# Altium schematic sheet Schem.SchDoc: Single cell LIPO battery charger
size A; DrawnBy: R Abhram; DocumentNumber: 1; Revision: V 1.0; SheetNumber: 1; SheetTotal: 1
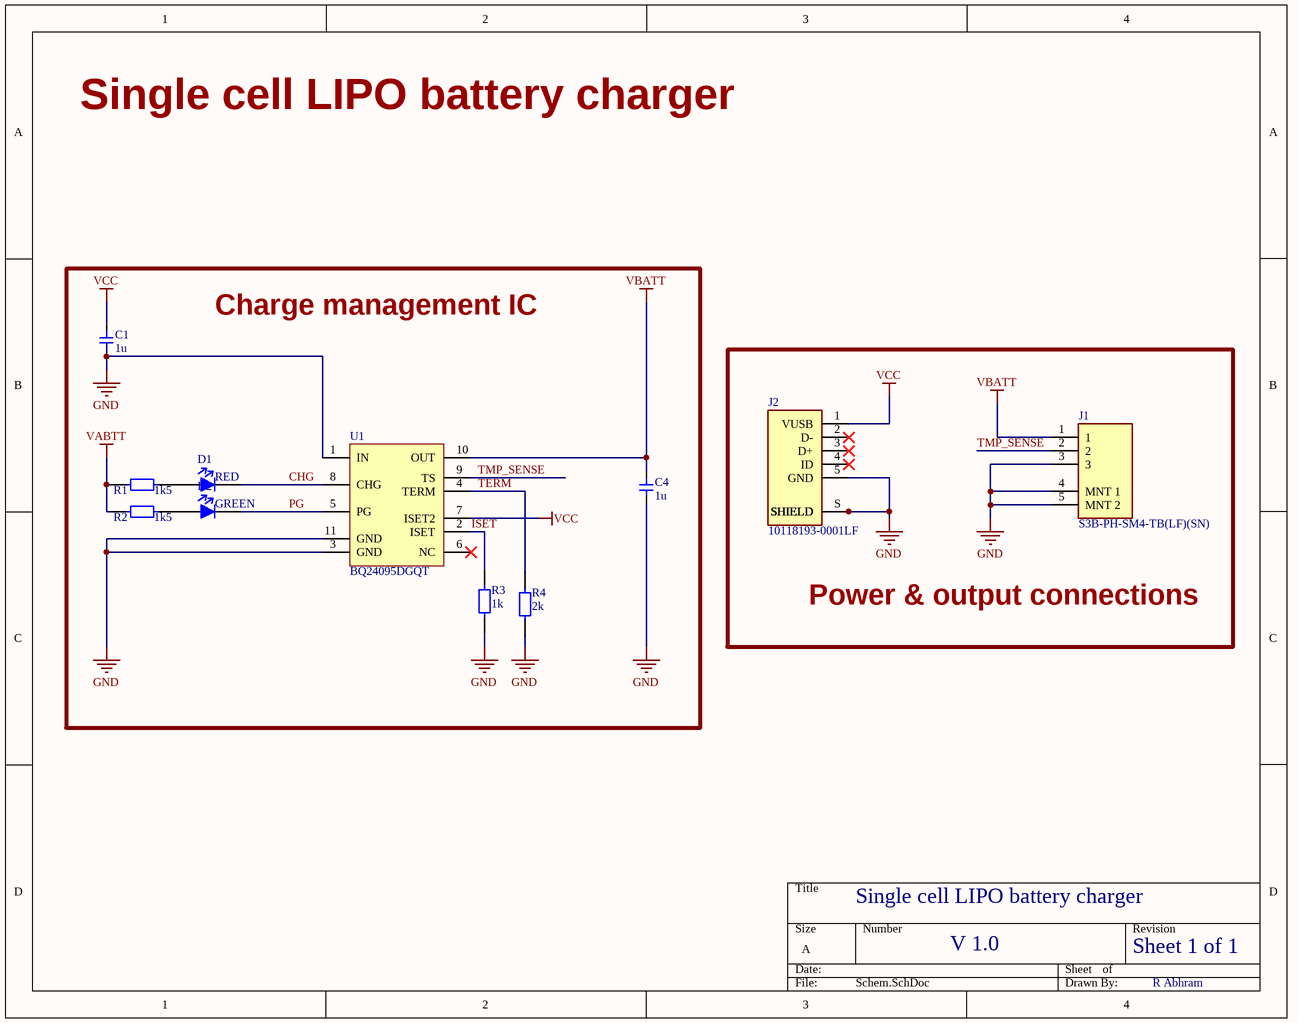
[diagram p0: Schem.SchDoc]

## Parts
C1  1u  [1U_0402_CAP]
C4  1u  [1U_0402_CAP]
D1  RED  [RED_LED]
D2  GREEN  [GREEN_LED]
J1  S3B-PH-SM4-TB(LF)(SN)  [JST_3POS]
J2  10118193-0001LF  [USB_PWR_CTR]
R1  1k5  [1K5_0402_RES]
R2  1k5  [1K5_0402_RES]
R3  1k  [1k_0402_RES]
R4  2k  [2K_0402_RES]
U1  BQ24095DGQT  [BATT_CHARGE_IC]

## Blocks framed on the sheet
Charge management IC: C1 C4 D1 D2 R1-R4 U1
Power & output connections: J1 J2

## Nets
GND: C1.1 C4.1 J1.3 J1.4(MNT_1) J1.5(MNT_2) J2.5(GND) J2.6(SHIELD) J2.S(SHIELD) R3.1 R4.1 U1.1(IN) U1.3(GND) U1.11(GND)
VABTT: R1.1 R2.1
VBATT: C4.2 J1.1 U1.10(OUT)
VCC: C1.2 J2.1(VUSB) U1.7(ISET2)
CHG: D1.2 U1.8(CHG)
ISET: R3.2 U1.2(ISET)
PG: D2.2 U1.5(PG)
TERM: R4.2 U1.4(TERM)
TMP_SENSE: J1.2 U1.9(TS)
NetD1_1: D1.1 R1.2
NetD2_1: D2.1 R2.2

Not connected (* = marked no-connect by the designer): J2 2(D-)* 3(D+)* 4(ID)*; U1 6(NC)*

## Notes on the sheet
- Sheet 1 of 1

## Library data of the parts
C1 C4 = CC0402KRX5R6BB105: CAP CER 1UF 10V X5R 0402; Manufacturer: Yageo; Material: 4241ConductorMaterial; Tolerance: 10%; Dissipation Factor: 15%; Supplier: Digikey; Supplier Part Number: 311-1439-1-ND; Manufacturer Part Number: CC0402KRX5R6BB105; RoHS: Yes; Category: Ceramic Capacitors; Stock: 603752; Pricing: 1=0.1, 10=0.07, 50=0.0418, 100=0.0329, 500=0.02428, 1000=0.0201, 2500=0.0187, 5000=0.01711 (USD); Mounting Technology: Surface Mount; Case/Package: 0402; Pins: 2; Case Code (Metric): 1005; Case Code (Imperial): 0402; Min Operating Temperature: -55°C; Max Operating Temperature: 85°C; Value: 1uF; Dielectric: X5R; Package Quantity: 1; Voltage Rating: 10V; Packaging: Tape and Reel; Voltage Rating (DC): 10V; Termination: SMD/SMT; Series: CC; Construction: Flat; Length: 1mm; Width: 0.02inch; Height: 0.5mm; Thickness: 0.022inch; Depth: 0.5mm; Radiation Hardening: No; Reach SVHC Compliant: No; RoHS Compliant: Yes; Halogen Free: 5694HalogenFree; Lead Free: 5697LeadFree; ComponentLink1URL: https://datasheet.ciiva.com/176/upy-gphc-x5r-4v-to-50v-12-176704.pdf?src-supplier=Digikey; ComponentLink1Description: https://datasheet.ciiva.com/176/upy-gphc-x5r-4v-to-50v-12-176704.pdf?src-supplier=Digikey; ComponentLink2URL: https://datasheet.ciiva.com/176/mlccorderingcode-176705.pdf?src-supplier=Digikey; ComponentLink2Description: https://datasheet.ciiva.com/176/mlccorderingcode-176705.pdf?src-supplier=Digikey; ComponentLink3URL: https://datasheet.ciiva.com/176/mlccorderingcode-176706.pdf?src-supplier=Digikey; ComponentLink3Description: https://datasheet.ciiva.com/176/mlccorderingcode-176706.pdf?src-supplier=Digikey
D1 = 150040RS73240: LED RED CLEAR 0402 SMD; Manufacturer: Wurth Electronics; Lens Color: Colorless; Lens Style: Flat; Luminous Intensity: 100mcd; Forward Voltage: 2V; Test Current: 20mA; Viewing Angle: 120°; Dominant Wavelength: 625nm; Forward Current: 60mA; Max Reverse Voltage (DC): 5V; Power Dissipation: 72mW; Lens Size: 0.5mm; Supplier: Digikey; Supplier Part Number: 732-11991-1-ND; Manufacturer Part Number: 150040RS73240; RoHS: Yes; Category: LEDs; Stock: 16784; Pricing: 1=0.31, 10=0.271, 100=0.244, 500=0.217, 1000=0.191 (USD); Mounting Technology: Surface Mount; Case/Package: 0402; Color: Red; Case Code (Imperial): 0402; Case Code (Metric): 1005; Min Operating Temperature: -40°C; Max Operating Temperature: 85°C; Packaging: Cut Tape; Lens Transparency: Clear; Series: WL-SMCC; Reverse Voltage: 5V; Wavelength: 625nm; Length: 1mm; Width: 0.5mm; Height: 0.5mm; RoHS Compliant: Yes; ComponentLink1URL: http://www.farnell.com/datasheets/2621636.pdf?src-supplier=Farnell; ComponentLink1Description: http://www.farnell.com/datasheets/2621636.pdf?src-supplier=Farnell; ComponentLink2URL: https://katalog.we-online.de/pbs/datasheet/150040RS73240.pdf?src-supplier=Digikey; ComponentLink2Description: https://katalog.we-online.de/pbs/datasheet/150040RS73240.pdf?src-supplier=Digikey; ComponentLink3URL: http://www.farnell.com/datasheets/2621636.pdf?src-supplier=Element14; ComponentLink3Description: http://www.farnell.com/datasheets/2621636.pdf?src-supplier=Element14; ComponentLink4URL: http://www.farnell.com/datasheets/2621636.pdf?src-supplier=Newark; ComponentLink4Description: http://www.farnell.com/datasheets/2621636.pdf?src-supplier=Newark
D2 = 150040VS73240: LED GREEN CLEAR 0402 SMD; Manufacturer: Wurth Electronics; Lens Color: Colorless; Lens Style: Flat; Luminous Intensity: 50mcd; Forward Voltage: 2V; Test Current: 20mA; Viewing Angle: 120°; Dominant Wavelength: 570nm; Forward Current: 60mA; Max Reverse Voltage (DC): 5V; Power Dissipation: 75mW; Lens Size: 0.5mm; Supplier: Digikey; Supplier Part Number: 732-11992-1-ND; Manufacturer Part Number: 150040VS73240; RoHS: Yes; Category: LEDs; Stock: 23651; Pricing: 1=0.31, 10=0.271, 100=0.244, 500=0.217, 1000=0.191 (USD); Mounting Technology: Surface Mount; Case/Package: 0402; Color: Green; Case Code (Imperial): 0402; Case Code (Metric): 1005; Min Operating Temperature: -40°C; Max Operating Temperature: 85°C; Packaging: Cut Tape; Lens Transparency: Clear; Series: WL-SMCC; Reverse Voltage: 5V; Wavelength: 570nm; Length: 1mm; Width: 0.5mm; Height: 0.5mm; RoHS Compliant: Yes; ComponentLink1URL: http://www.farnell.com/datasheets/2621637.pdf?src-supplier=Farnell; ComponentLink1Description: http://www.farnell.com/datasheets/2621637.pdf?src-supplier=Farnell; ComponentLink2URL: http://www.farnell.com/datasheets/2621637.pdf?src-supplier=Element14; ComponentLink2Description: http://www.farnell.com/datasheets/2621637.pdf?src-supplier=Element14; ComponentLink3URL: https://katalog.we-online.de/pbs/datasheet/150040VS73240.pdf?src-supplier=Digikey; ComponentLink3Description: https://katalog.we-online.de/pbs/datasheet/150040VS73240.pdf?src-supplier=Digikey; ComponentLink4URL: http://www.farnell.com/datasheets/2621637.pdf?src-supplier=Newark; ComponentLink4Description: http://www.farnell.com/datasheets/2621637.pdf?src-supplier=Newark
J1 = S3B-PH-SM4-TB(LF)(SN): Connector Header, PH Series, 3 Position, Side Entry, 2.00mm, Solder, Surface Mount, Natural.; Manufacturer: JST; Current Rating: 2A; Voltage Rating: 100V; Contact Resistance: 10mR; Number of Poles: 3; Insulation Resistance: 1GR; Gender: Male; Pitch: 2mm; Supplier: Farnell; Supplier Part Number: 9492623; Manufacturer Part Number: S3B-PH-SM4-TB(LF)(SN); RoHS: Yes; Category: Headers and Wire Housings; Stock: 62261; Pricing: 10=0.409, 100=0.29, 500=0.246, 1000=0.215, 2500=0.2, 5000=0.187 (GBP); Mounting Technology: Surface Mount; Contact Material: Copper Alloy,Tin,Bronze,Brass; Contact Plating: Tin,Copper; Color: Natural,White; Housing Color: Beige; Housing Material: Polyamide; Material: Polyamide; Contact Shape: Square; Insulation Material: Nylon; Insulation Color: Natural; Contact Finish - Mating: TIN; Weight: 28.349523g; Min Operating Temperature: -25°C; Max Operating Temperature: 85°C; Number of Rows: 1; Voltage Rating (AC): 100V; Max Current Rating: 2A; Packaging: Tape and Reel; Number of Positions: 3; Termination: Solder; Fastening Type: Detent; Number of Contacts: 3; Working Voltage: 100V; Max Voltage Rating (AC): 100V; Max Voltage Rating (DC): 100V; Orientation: Right Angle; Connector Type: Header; Series: PH; Contact Type: Male Pin; Voltage Rating (DC): 100V; Length: 9.9mm; Width: 5mm; Height: 9.4mm; Lead Pitch: 2mm; Contact Mating Length: 0.13inch; Depth: 7.6mm; Reach SVHC Compliant: No; Flammability Rating: UL94 V-0; Lead Free: 5697LeadFree; ComponentLink1URL: https://datasheet.ciiva.com/11748/0900766b80df0d9d-11748720.pdf?src-supplier=Rs; ComponentLink1Description: https://datasheet.ciiva.com/11748/0900766b80df0d9d-11748720.pdf?src-supplier=Rs; ComponentLink2URL: https://datasheet.ciiva.com/16201/jst20s3b-ph-sm4-tb-lf-sn-16201903.pdf?src-supplier=Future+Electronics; ComponentLink2Description: https://datasheet.ciiva.com/16201/jst20s3b-ph-sm4-tb-lf-sn-16201903.pdf?src-supplier=Future+Electronics; ComponentLink3URL: https://datasheet.ciiva.com/712/eph-712555.pdf?src-supplier=Digikey; ComponentLink3Description: https://datasheet.ciiva.com/712/eph-712555.pdf?src-supplier=Digikey; ComponentLink4URL: https://datasheet.ciiva.com/712/eph-712554.pdf?src-supplier=Digikey; ComponentLink4Description: https://datasheet.ciiva.com/712/eph-712554.pdf?src-supplier=Digikey; ComponentLink5URL: https://datasheet.ciiva.com/712/eph-712556.pdf?src-supplier=Digikey; ComponentLink5Description: https://datasheet.ciiva.com/712/eph-712556.pdf?src-supplier=Digikey; ComponentLink6URL: https://datasheet.ciiva.com/8052/80594-8052219.pdf?src-supplier=Element14; ComponentLink6Description: https://datasheet.ciiva.com/8052/80594-8052219.pdf?src-supplier=Element14; ComponentLink7URL: https://datasheet.ciiva.com/22693/80594-22693485.pdf?src-supplier=Element14; ComponentLink7Description: https://datasheet.ciiva.com/22693/80594-22693485.pdf?src-supplier=Element14
J2 = 10118193-0001LF: CONN RCPT USB2.0 MICRO B SMD R/A; Manufacturer: Amphenol ICC / FCI; Connector Type: USB,Receptacle; Number of Contacts: 5; Gender: Female; Insulation Resistance: 1GR; Number of Ports: 1; Current Rating: 1.8A; Max Voltage Rating (AC): 100V; Pitch: 0.65mm; Supplier: Digikey; Supplier Part Number: 609-4616-1-ND; Manufacturer Part Number: 10118193-0001LF; RoHS: No; Category: LDO; Stock: 195868; Pricing: 1=0.57, 10=0.43, 25=0.3864, 50=0.3566, 100=0.3293, 250=0.29696, 500=0.27504 (USD); Mounting Technology: Surface Mount,Horizontal; Pins: 5; Color: Black; Contact Material: Copper Alloy; Contact Plating: Gold; Housing Material: Polymer; Min Operating Temperature: -55°C; Max Operating Temperature: 85°C; Orientation: Right Angle; Termination: Solder; Features: Shielded; Series: -; Packaging: Tape and Reel; Package Quantity: 1200; Voltage Rating: 100V; Length: 7.86mm; Depth: 5.67mm; Radiation Hardening: No; Flammability Rating: UL94 V-0; ComponentLink1URL: https://cdn.amphenol-icc.com/media/wysiwyg/files/documentation/datasheet/inputoutput/io_usb_micro.pdf?src-supplier=Arrow+Electronics; ComponentLink1Description: https://cdn.amphenol-icc.com/media/wysiwyg/files/documentation/datasheet/inputoutput/io_usb_micro.pdf?src-supplier=Arrow+Electronics; ComponentLink2URL: https://cdn.amphenol-icc.com/media/wysiwyg/files/documentation/datasheet/inputoutput/io_usb_micro.pdf?src-supplier=Onlinecomponents.com; ComponentLink2Description: https://cdn.amphenol-icc.com/media/wysiwyg/files/documentation/datasheet/inputoutput/io_usb_micro.pdf?src-supplier=Onlinecomponents.com; ComponentLink3URL: https://cdn.amphenol-icc.com/media/wysiwyg/files/documentation/datasheet/inputoutput/io_usb_micro.pdf?src-supplier=Verical; ComponentLink3Description: https://cdn.amphenol-icc.com/media/wysiwyg/files/documentation/datasheet/inputoutput/io_usb_micro.pdf?src-supplier=Verical; ComponentLink4URL: https://datasheet.octopart.com/10118193-0001LF-Amphenol-Communications-Solutions-datasheet-96019471.pdf?src-supplier=Element14; ComponentLink4Description: https://datasheet.octopart.com/10118193-0001LF-Amphenol-Communications-Solutions-datasheet-96019471.pdf?src-supplier=Element14; ComponentLink5URL: https://cdn.amphenol-icc.com/media/wysiwyg/files/documentation/datasheet/inputoutput/io_usb_micro.pdf?src-supplier=Avnet; ComponentLink5Description: https://cdn.amphenol-icc.com/media/wysiwyg/files/documentation/datasheet/inputoutput/io_usb_micro.pdf?src-supplier=Avnet; ComponentLink6URL: https://cdn.amphenol-icc.com/media/wysiwyg/files/documentation/datasheet/inputoutput/io_usb_micro.pdf?src-supplier=TTI; ComponentLink6Description: https://cdn.amphenol-icc.com/media/wysiwyg/files/documentation/datasheet/inputoutput/io_usb_micro.pdf?src-supplier=TTI; ComponentLink7URL: https://datasheet.octopart.com/10118193-0001LF-Amphenol-Communications-Solutions-datasheet-11792339.pdf?src-supplier=Electro+Sonic; ComponentLink7Description: https://datasheet.octopart.com/10118193-0001LF-Amphenol-Communications-Solutions-datasheet-11792339.pdf?src-supplier=Electro+Sonic
R1 R2 = RT0402BRD071K5L: RES SMD 1.5K OHM 0.1% 1/16W 0402; Manufacturer: Yageo; Supplier: Digikey; Supplier Part Number: YAG1380CT-ND; Manufacturer Part Number: RT0402BRD071K5L; RoHS: Yes; Category: Chip SMD Resistors; Stock: 28812; Pricing: 1=0.16, 10=0.121, 50=0.0958, 100=0.0859, 500=0.0654, 1000=0.0578, 5000=0.04283 (USD); ComponentLink1URL: https://datasheet.ciiva.com/2582/pyu-rt-1-to-0-05-rohs-l-4-2582207.pdf?src-supplier=Digikey; ComponentLink1Description: https://datasheet.ciiva.com/2582/pyu-rt-1-to-0-05-rohs-l-4-2582207.pdf?src-supplier=Digikey
R3 = RC0402JR-071KL: RES 1K OHM 5% 1/16W 0402; Manufacturer: Yageo; Voltage Rating: 50V; Value: 1kR; Power Rating: 62.5mW; Temperature Coefficient: 100ppm/°C; Max Power Dissipation: 63mW; Supplier: Digikey; Supplier Part Number: 311-1.0KJRCT-ND; Manufacturer Part Number: RC0402JR-071KL; RoHS: Yes; Category: Chip SMD Resistors; Stock: 13704362; Pricing: 1=0.1, 10=0.018, 50=0.0102, 100=0.0083, 500=0.00528, 1000=0.00444, 5000=0.00307 (USD); Case/Package: 0402; Case Code (Imperial): 0402; Case Code (Metric): 1005; Min Operating Temperature: -55°C; Max Operating Temperature: 155°C; Packaging: Cut Tape; Termination: SMD/SMT; Series: RC; Voltage Rating (AC): 50V; Tolerance: 5%; Package Quantity: 1; Resistor Type: Thick Film; Number of Terminations: 2; Features: Moisture Resistant; Resistance Tolerance: 5%; Length: 0.039inch; Width: 0.02inch; Height: 0.016inch; Reach SVHC Compliant: No; Lead Free: 5697LeadFree; RoHS Compliant: Yes
R4 = RC0402FR-072KL: RES 2K OHM 1% 1/16W 0402; Manufacturer: Yageo; Value: 2kR; Power Rating: 63mW; Voltage Rating: 50V; Temperature Coefficient: 100ppm/°C; Supplier: Digikey; Supplier Part Number: 311-2KLRCT-ND; Manufacturer Part Number: RC0402FR-072KL; RoHS: Yes; Category: Chip SMD Resistors; Stock: 2671664; Pricing: 1=0.1, 10=0.015, 50=0.0088, 100=0.0073, 500=0.00488, 1000=0.00417, 5000=0.00297, 10000=0.00261, 20000=0.00231, 30000=0.00216, 50000=0.00199, 100000=0.00179 (USD); Case/Package: 0402; Case Code (Metric): 1005; Case Code (Imperial): 0402; Min Operating Temperature: -55°C; Max Operating Temperature: 155°C; Resistor Type: Thick Film; Tolerance: 1%; Package Quantity: 1; Packaging: Tape and Reel; Number of Terminations: 2; Termination: SMD/SMT; Max Power Dissipation: 63mW; Working Voltage: 50V; Features: Moisture Resistant; Series: RC; Technology: THICK FILM; Construction: Rectangular; Resistance Tolerance: 1%; Voltage Rating (DC): 50V; Length: 0.039inch; Width: 0.02inch; Height: 0.016inch; Depth: 0.5mm; RoHS Compliant: Yes; Military Standard: Not; Reach SVHC Compliant: Unknown; Lead Free: 5697LeadFree; ComponentLink1URL: https://datasheet.ciiva.com/11808/0900766b80c66297-11808787.pdf?src-supplier=Rs; ComponentLink1Description: https://datasheet.ciiva.com/11808/0900766b80c66297-11808787.pdf?src-supplier=Rs; ComponentLink2URL: https://datasheet.ciiva.com/7849/1018594-7849934.pdf?src-supplier=Element14; ComponentLink2Description: https://datasheet.ciiva.com/7849/1018594-7849934.pdf?src-supplier=Element14; ComponentLink3URL: https://datasheet.ciiva.com/7849/1018594-7849935.pdf?src-supplier=Element14; ComponentLink3Description: https://datasheet.ciiva.com/7849/1018594-7849935.pdf?src-supplier=Element14; ComponentLink4URL: https://datasheet.ciiva.com/7983/1018594-7983517.pdf?src-supplier=Element14; ComponentLink4Description: https://datasheet.ciiva.com/7983/1018594-7983517.pdf?src-supplier=Element14; ComponentLink5URL: https://datasheet.ciiva.com/2453/pyu-r-int-thick-7-2453635.pdf?src-supplier=Digikey; ComponentLink5Description: https://datasheet.ciiva.com/2453/pyu-r-int-thick-7-2453635.pdf?src-supplier=Digikey; ComponentLink6URL: https://datasheet.ciiva.com/2453/pyu-r-int-thick-7-2453636.pdf?src-supplier=Digikey; ComponentLink6Description: https://datasheet.ciiva.com/2453/pyu-r-int-thick-7-2453636.pdf?src-supplier=Digikey; ComponentLink7URL: https://datasheet.ciiva.com/2453/pyu-r-int-thick-7-2453634.pdf?src-supplier=Digikey; ComponentLink7Description: https://datasheet.ciiva.com/2453/pyu-r-int-thick-7-2453634.pdf?src-supplier=Digikey; ComponentLink8URL: https://datasheet.ciiva.com/12667/pyu-rc0402-51-rohs-l-6-r-12667451.pdf?src-supplier=Mouser; ComponentLink8Description: https://datasheet.ciiva.com/12667/pyu-rc0402-51-rohs-l-6-r-12667451.pdf?src-supplier=Mouser; ComponentLink9URL: https://datasheet.ciiva.com/15189/getdatasheetpartid-358921-15189414.pdf?src-supplier=Verical; ComponentLink9Description: https://datasheet.ciiva.com/15189/getdatasheetpartid-358921-15189414.pdf?src-supplier=Verical
U1 = BQ24095DGQT: IC BATT CHG LI-ION 1CELL 10MSOP; Manufacturer: Texas Instruments; Supplier: Digikey; Supplier Part Number: 296-BQ24095DGQTCT-ND; Manufacturer Part Number: BQ24095DGQT; RoHS: Yes; Category: Battery Management; Stock: 275; Pricing: 1=1.97, 10=1.766, 25=1.6664, 100=1.4199 (USD); ComponentLink1URL: https://datasheet.ciiva.com/24110/slus968e-316287-24110136.pdf?src-supplier=Mouser; ComponentLink1Description: https://datasheet.ciiva.com/24110/slus968e-316287-24110136.pdf?src-supplier=Mouser; ComponentLink2URL: https://datasheet.ciiva.com/30000/bq24092-30000407.pdf?src-supplier=Avnet; ComponentLink2Description: https://datasheet.ciiva.com/30000/bq24092-30000407.pdf?src-supplier=Avnet